# Altium schematic sheet HW_V5.0.SchDoc
size 381 x 241 mm; SheetNumber: 1; SheetTotal: 1
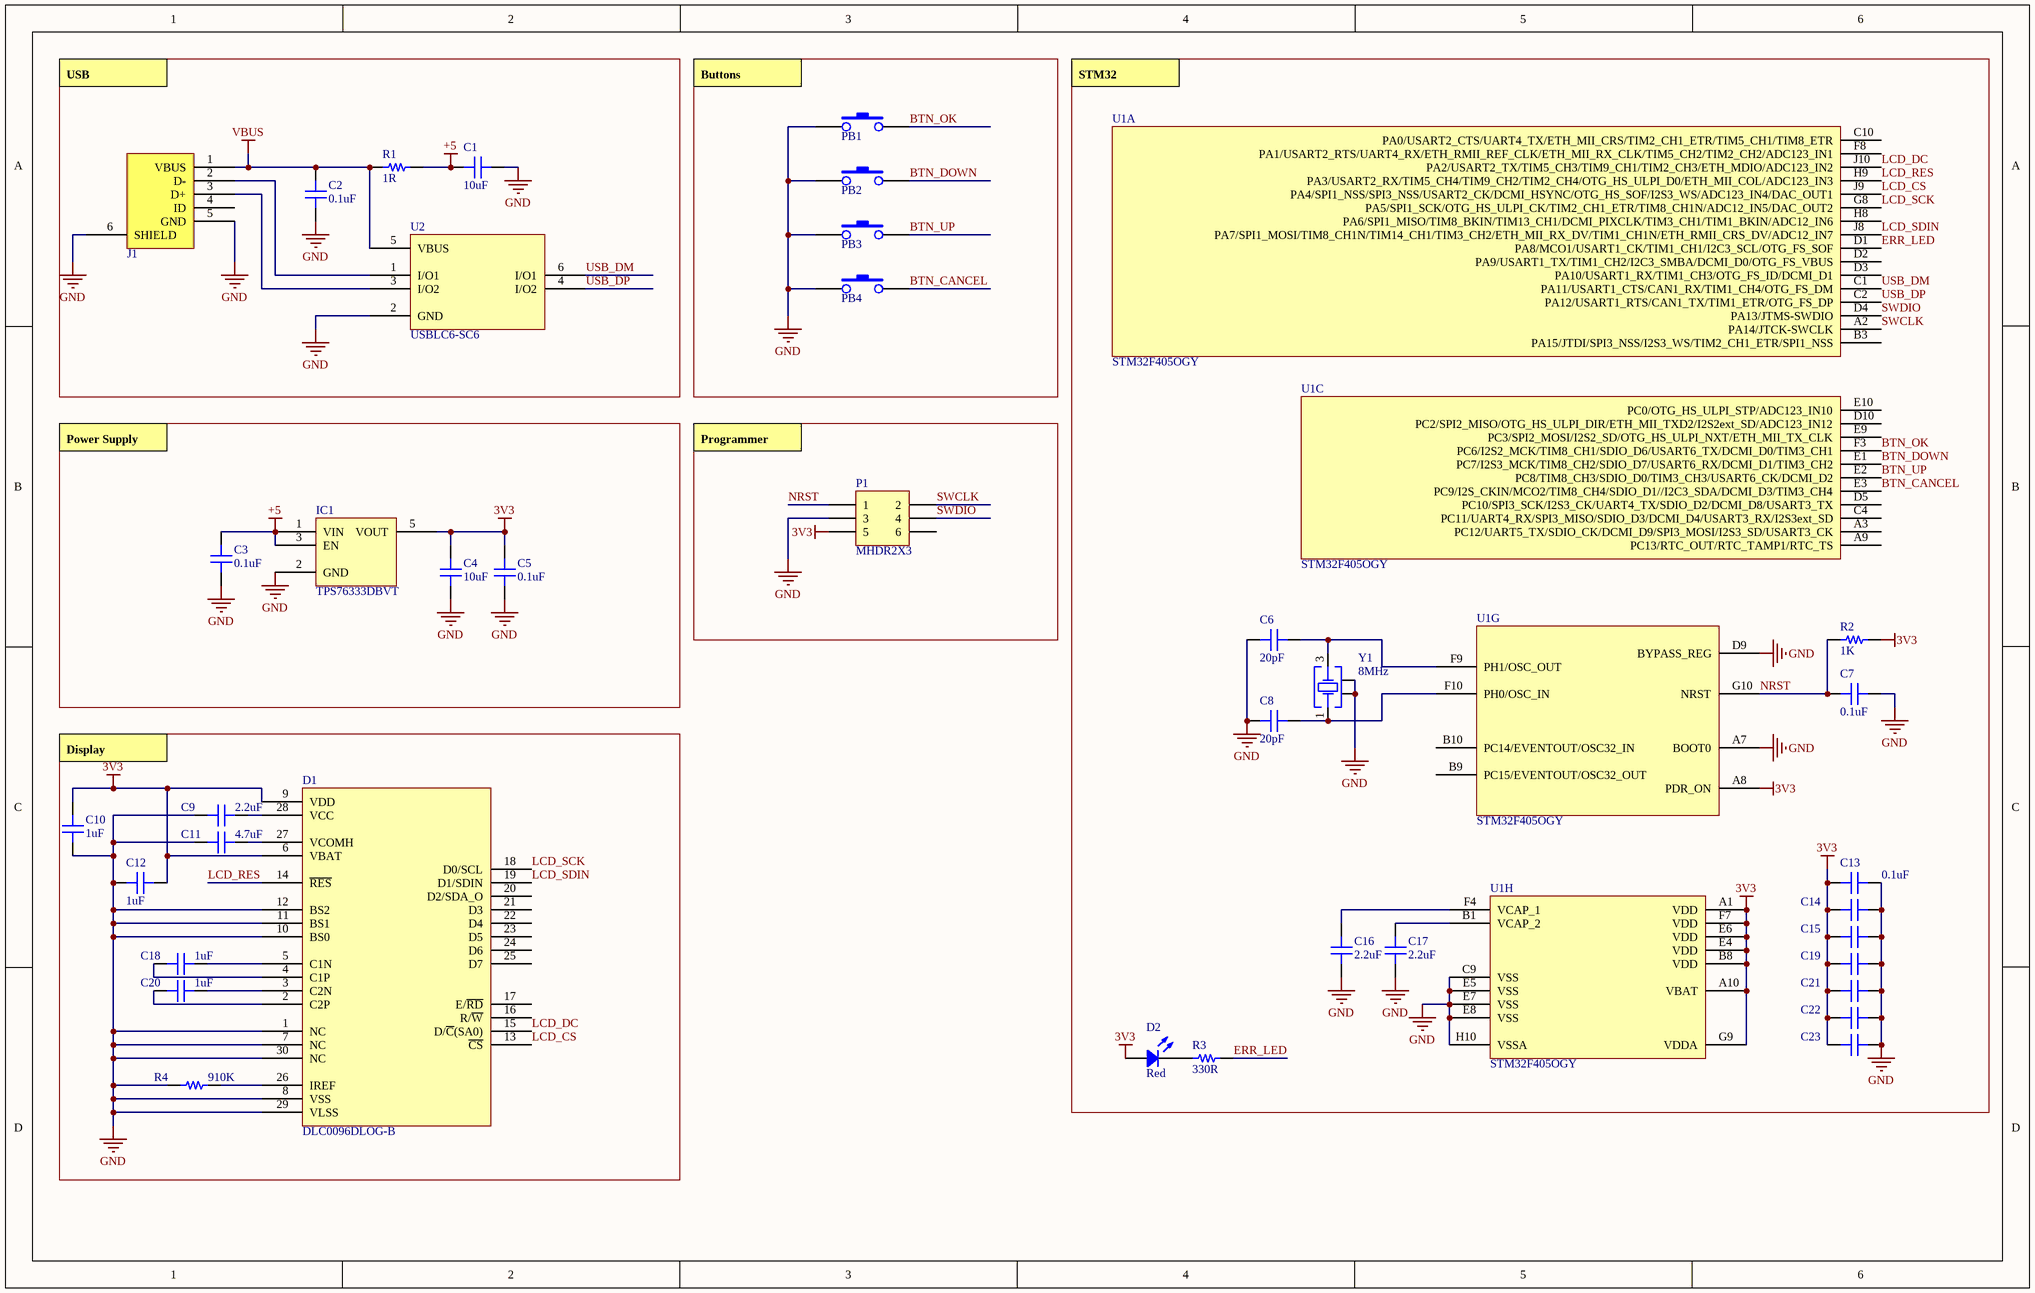
[diagram p0: HW_V5.0.SchDoc]

## Parts
C1  10uF  [CAP 0603/1608]
C2  0.1uF  [CAP 0603/1608]
C3  0.1uF  [CAP 0603/1608]
C4  10uF  [CAP 0603/1608]
C5  0.1uF  [CAP 0603/1608]
C6  20pF  [CAP 0603/1608]
C7  0.1uF  [CAP 0603/1608]
C8  20pF  [CAP 0603/1608]
C9  2.2uF  [CAP 0603/1608]
C10  1uF  [CAP 0603/1608]
C11  4.7uF  [CAP 0603/1608]
C12  1uF  [CAP 0603/1608]
C13  0.1uF  [CAP 0603/1608]
C14  0.1uF  [CAP 0603/1608]  (value not drawn)
C15  0.1uF  [CAP 0603/1608]  (value not drawn)
C16  2.2uF  [CAP 0603/1608]
C17  2.2uF  [CAP 0603/1608]
C18  1uF  [CAP 0603/1608]
C19  0.1uF  [CAP 0603/1608]  (value not drawn)
C20  1uF  [CAP 0603/1608]
C21  0.1uF  [CAP 0603/1608]  (value not drawn)
C22  0.1uF  [CAP 0603/1608]  (value not drawn)
C23  0.1uF  [CAP 0603/1608]  (value not drawn)
D1  DLC0096DLOG-B  [PMOLED_0096_TOP_CONB]
D2  Red  [LED 0603/1608 RED]
IC1  TPS76333DBVT  [TI SOT-23-5 DBV]
J1  U-F-M5DD-W-L  [U-F-M5DD-W-L]  (value not drawn)
P1  MHDR2X3  [MHDR2X3]
PB1  Tactile Switch 3.7 x 3.7  [SW_375_375_4PIN]  (value not drawn)
PB2  Tactile Switch 3.7 x 3.7  [SW_375_375_4PIN]  (value not drawn)
PB3  Tactile Switch 3.7 x 3.7  [SW_375_375_4PIN]  (value not drawn)
PB4  Tactile Switch 3.7 x 3.7  [SW_375_375_4PIN]  (value not drawn)
R1  1R  [RES 0603/1608]
R2  1K  [RES 0603/1608]
R3  330R  [RES 0603/1608]
R4  910K  [RES 0603/1608]
U1  STM32F405OGY  [STM-WLCSP90]  (parts A,C,G,H of 8)
U2  USBLC6-SC6  [ST SOT-23-6]
Y1  8MHz  [WE-XTAL_CFPX-180]

## Nets
3V3: C4.2 C5.2 C10.2 C12.1 C13.2 C14.2 C15.2 C19.2 C21.2 C22.2 C23.2 D1.6(VBAT) D1.9(VDD) D2.1 IC1.5(VOUT) P1.5 R2.2 U1.A1(VDD) U1.A8(PDR_ON) U1.A10(VBAT) U1.B8(VDD) U1.E4(VDD) U1.E6(VDD) U1.F7(VDD) U1.G9(VDDA)
+5: C1.2 C3.2 IC1.1(VIN) IC1.3(EN) R1.2
GND: C1.1 C2.1 C3.1 C4.1 C5.1 C6.1 C7.1 C8.1 C9.2 C10.1 C11.1 C12.2 C13.1 C14.1 C15.1 C16.1 C17.1 C19.1 C21.1 C22.1 C23.1 D1.1(NC) D1.7(NC) D1.8(VSS) D1.10(BS0) D1.11(BS1) D1.12(BS2) D1.29(VLSS) D1.30(NC) IC1.2(GND) J1.5(GND) J1.6(SHIELD) P1.3 PB1.1 PB2.1 PB3.1 PB4.1 R4.1 U1.A7(BOOT0) U1.C9(VSS) U1.D9(BYPASS_REG) U1.E5(VSS) U1.E7(VSS) U1.E8(VSS) U1.H10(VSSA) U2.2(GND) Y1.2(GND&Lid) Y1.4(GND&Lid)
VBUS: C2.2 J1.1(VBUS) R1.1 U2.5(VBUS)
BTN_CANCEL: PB4.2 U1.E3(PC9/I2S_CKIN/MCO2/TIM8_CH4/SDIO_D1//I2C3_SDA/DCMI_D3/TIM3_CH4)
BTN_DOWN: PB2.2 U1.E1(PC7/I2S3_MCK/TIM8_CH2/SDIO_D7/USART6_RX/DCMI_D1/TIM3_CH2)
BTN_OK: PB1.2 U1.F3(PC6/I2S2_MCK/TIM8_CH1/SDIO_D6/USART6_TX/DCMI_D0/TIM3_CH1)
BTN_UP: PB3.2 U1.E2(PC8/TIM8_CH3/SDIO_D0/TIM3_CH3/USART6_CK/DCMI_D2)
ERR_LED: R3.2 U1.D1(PA8/MCO1/USART1_CK/TIM1_CH1/I2C3_SCL/OTG_FS_SOF)
LCD_CS: D1.13(~{CS}) U1.J9(PA4/SPI1_NSS/SPI3_NSS/USART2_CK/DCMI_HSYNC/OTG_HS_SOF/I2S3_WS/ADC123_IN4/DAC_OUT1)
LCD_DC: D1.15(D/~{C}(SA0)) U1.J10(PA2/USART2_TX/TIM5_CH3/TIM9_CH1/TIM2_CH3/ETH_MDIO/ADC123_IN2)
LCD_RES: D1.14(~{RES}) U1.H9(PA3/USART2_RX/TIM5_CH4/TIM9_CH2/TIM2_CH4/OTG_HS_ULPI_D0/ETH_MII_COL/ADC123_IN3)
LCD_SCK: D1.18(D0/SCL) U1.G8(PA5/SPI1_SCK/OTG_HS_ULPI_CK/TIM2_CH1_ETR/TIM8_CH1N/ADC12_IN5/DAC_OUT2)
LCD_SDIN: D1.19(D1/SDIN) U1.J8(PA7/SPI1_MOSI/TIM8_CH1N/TIM14_CH1/TIM3_CH2/ETH_MII_RX_DV/TIM1_CH1N/ETH_RMII_CRS_DV/ADC12_IN7)
NRST: C7.2 P1.1 R2.1 U1.G10(NRST)
SWCLK: P1.2 U1.A2(PA14/JTCK-SWCLK)
SWDIO: P1.4 U1.D4(PA13/JTMS-SWDIO)
USB_DM: U1.C1(PA11/USART1_CTS/CAN1_RX/TIM1_CH4/OTG_FS_DM) U2.6(I/O1)
USB_DP: U1.C2(PA12/USART1_RTS/CAN1_TX/TIM1_ETR/OTG_FS_DP) U2.4(I/O2)
NetC6_2: C6.2 U1.F9(PH1/OSC_OUT) Y1.3(Crystal)
NetC8_2: C8.2 U1.F10(PH0/OSC_IN) Y1.1(Crystal)
NetC9_1: C9.1 D1.28(VCC)
NetC11_2: C11.2 D1.27(VCOMH)
NetC16_2: C16.2 U1.F4(VCAP_1)
NetC17_2: C17.2 U1.B1(VCAP_2)
NetC18_1: C18.1 D1.4(C1P)
NetC18_2: C18.2 D1.5(C1N)
NetC20_1: C20.1 D1.2(C2P)
NetC20_2: C20.2 D1.3(C2N)
NetD1_26: D1.26(IREF) R4.2
NetD2_2: D2.2 R3.1
NetJ1_2: J1.2(D-) U2.1(I/O1)
NetJ1_3: J1.3(D+) U2.3(I/O2)

Not connected (* = marked no-connect by the designer): D1 16(R/~{W}) 17(E/~{RD}) 20(D2/SDA_O) 21(D3) 22(D4) 23(D5) 24(D6) 25(D7); J1 4(ID); P1 6; U1 A3(PC12/UART5_TX/SDIO_CK/DCMI_D9/SPI3_MOSI/I2S3_SD/USART3_CK) A9(PC13/RTC_OUT/RTC_TAMP1/RTC_TS) B3(PA15/JTDI/SPI3_NSS/I2S3_WS/TIM2_CH1_ETR/SPI1_NSS) B9(PC15/EVENTOUT/OSC32_OUT) B10(PC14/EVENTOUT/OSC32_IN) C4(PC11/UART4_RX/SPI3_MISO/SDIO_D3/DCMI_D4/USART3_RX/I2S3ext_SD) C10(PA0/USART2_CTS/UART4_TX/ETH_MII_CRS/TIM2_CH1_ETR/TIM5_CH1/TIM8_ETR) D2(PA9/USART1_TX/TIM1_CH2/I2C3_SMBA/DCMI_D0/OTG_FS_VBUS) D3(PA10/USART1_RX/TIM1_CH3/OTG_FS_ID/DCMI_D1) D5(PC10/SPI3_SCK/I2S3_CK/UART4_TX/SDIO_D2/DCMI_D8/USART3_TX) D10(PC2/SPI2_MISO/OTG_HS_ULPI_DIR/ETH_MII_TXD2/I2S2ext_SD/ADC123_IN12) E9(PC3/SPI2_MOSI/I2S2_SD/OTG_HS_ULPI_NXT/ETH_MII_TX_CLK) E10(PC0/OTG_HS_ULPI_STP/ADC123_IN10) F8(PA1/USART2_RTS/UART4_RX/ETH_RMII_REF_CLK/ETH_MII_RX_CLK/TIM5_CH2/TIM2_CH2/ADC123_IN1) H8(PA6/SPI1_MISO/TIM8_BKIN/TIM13_CH1/DCMI_PIXCLK/TIM3_CH1/TIM1_BKIN/ADC12_IN6)

## Notes on the sheet
- USB
- Buttons
- STM32
- Power Supply
- Programmer
- Display

## Library data of the parts
C1 C4 = CL10A106MQ8NNNC: CAP CER 10UF 6.3V X5R 0603; Manufacturer: Samsung Electro-Mechanics America, Inc.; TemperatureRange: -55C ~ 85C; Tolerance: 20%; Value: 10uF; Part Number: CL10A106MQ8NNNC; PartId: 13031; Supplier 1: Digi-Key; Supplier Part Number 1: 1276-1119-2-ND; ComponentLink1Description: Datasheet; ComponentLink1URL: http://www.samsungsem.com/kr/support/product-search/mlcc/CL10A106MQ8NNNC.jsp; ComponentLink2Description: Digi-Key Listing; ComponentLink2URL: https://www.digikey.com/product-detail/en/samsung-electro-mechanics-america-inc/CL10A106MQ8NNNC/1276-1119-2-ND/3886777; TemperatureCoefficient: X5R; Voltage: 6.3V; Price: 0.0274; Device Package: 0603 (1608 Metric)
C2 C3 C5 C7 C13-C15 C19 C21-C23 = CL10B104JO8NNNC: CAP CER 0.1UF 16V X7R 0603; Manufacturer: Samsung Electro-Mechanics America, Inc.; TemperatureRange: -55C ~ 125C; Tolerance: 5%; Value: 0.1uF; Part Number: CL10B104JO8NNNC; PartId: 5417; Supplier 1: Digi-Key; Supplier Part Number 1: 1276-1061-2-ND; ComponentLink1Description: Datasheet; ComponentLink1URL: http://www.samsungsem.com/kr/support/product-search/mlcc/CL10B104JO8NNNC.jsp; ComponentLink2Description: Digi-Key listing; ComponentLink2URL: http://digikey.com/product-detail/en/CL10B104JO8NNNC/1276-1061-2-ND/3886719; TemperatureCoefficient: X7R; Voltage: 16V; Price: 0.0132; Type: -; Device Package: 0603 (1608 Metric)
C6 C8 = CL10C200JB8NNNC: CAP CER 20PF 50V NP0 0603; Manufacturer: Samsung Electro-Mechanics America, Inc.; TemperatureRange: -55C ~ 125C; TemperatureCoefficient: C0G, NP0; Tolerance: 5%; Value: 20pF; Part Number: CL10C200JB8NNNC; PartId: 5318; Supplier 1: Digi-Key; Supplier Part Number 1: 1276-1187-2-ND; ComponentLink1Description: Datasheet; ComponentLink1URL: http://www.samsungsem.com/kr/support/product-search/mlcc/CL10C200JB8NNNC.jsp; ComponentLink2Description: Digi-Key listing; ComponentLink2URL: http://digikey.com/product-detail/en/CL10C200JB8NNNC/1276-1187-2-ND/3886845; Voltage: 50V; Price: 0.0085; Type: -; Device Package: 0603 (1608 Metric)
C9 C16 C17 = CL10A225KO5LNNC: CAP CER 2.2UF 16V X5R 0603; Manufacturer: Samsung Electro-Mechanics; TemperatureRange: -55C ~ 85C; Tolerance: 10%; Value: 2.2uF; Part Number: CL10A225KO5LNNC; PartId: 30554; Supplier 1: Digi-Key; Supplier Part Number 1: 1276-1880-2-ND; ComponentLink1Description: Datasheet; ComponentLink1URL: http://www.samsungsem.com/kr/support/product-search/mlcc/CL10A225KO5LNNC.jsp; ComponentLink2Description: Digi-Key Listing; ComponentLink2URL: https://www.digikey.com/product-detail/en/samsung-electro-mechanics/CL10A225KO5LNNC/1276-1880-2-ND/3887538; TemperatureCoefficient: X5R; Voltage: 16V; Price: 0; Device Package: 0603 (1608 Metric)
C10 C12 = CL10A105KO8NNNC: CAP CER 1UF 16V X5R 0603; Manufacturer: Samsung Electro-Mechanics America, Inc.; TemperatureRange: -55C ~ 85C; Tolerance: 10%; Value: 1uF; Part Number: CL10A105KO8NNNC; PartId: 13125; Supplier 1: Digi-Key; Supplier Part Number 1: 1276-1034-2-ND; ComponentLink1Description: Datasheet; ComponentLink1URL: http://www.samsungsem.com/kr/support/product-search/mlcc/CL10A105KO8NNNC.jsp; ComponentLink2Description: Digi-Key Listing; ComponentLink2URL: https://www.digikey.com/product-detail/en/samsung-electro-mechanics-america-inc/CL10A105KO8NNNC/1276-1034-2-ND/3886692; TemperatureCoefficient: X5R; Voltage: 16V; Price: 0.0072; Device Package: 0603 (1608 Metric)
C11 = CL10A475KO8NNNC: CAP CER 4.7UF 16V X5R 0603; Manufacturer: Samsung Electro-Mechanics America, Inc.; TemperatureRange: -55C ~ 85C; Tolerance: 10%; Value: 4.7uF; Part Number: CL10A475KO8NNNC; PartId: 13180; Supplier 1: Digi-Key; Supplier Part Number 1: 1276-1784-2-ND; ComponentLink1Description: Datasheet; ComponentLink1URL: http://www.samsungsem.com/kr/support/product-search/mlcc/CL10A475KO8NNNC.jsp; ComponentLink2Description: Digi-Key Listing; ComponentLink2URL: https://www.digikey.com/product-detail/en/samsung-electro-mechanics-america-inc/CL10A475KO8NNNC/1276-1784-2-ND/3887442; TemperatureCoefficient: X5R; Voltage: 16V; Price: 0.0499; Device Package: 0603 (1608 Metric)
C18 C20 = CL10A105KA8NNNC: CAP CER 1UF 25V X5R 0603; Manufacturer: Samsung Electro-Mechanics America, Inc.; TemperatureRange: -55C ~ 85C; Tolerance: 10%; Value: 1uF; Part Number: CL10A105KA8NNNC; PartId: 13209; Supplier 1: Digi-Key; Supplier Part Number 1: 1276-1102-2-ND; ComponentLink1Description: Datasheet; ComponentLink1URL: http://www.samsungsem.com/kr/support/product-search/mlcc/CL10A105KA8NNNC.jsp; ComponentLink2Description: Digi-Key Listing; ComponentLink2URL: https://www.digikey.com/product-detail/en/samsung-electro-mechanics-america-inc/CL10A105KA8NNNC/1276-1102-2-ND/3886760; TemperatureCoefficient: X5R; Voltage: 25V; Price: 0.0082; Device Package: 0603 (1608 Metric)
D2 = LTST-C191KRKT: LED RED CLEAR 0603 SMD; Manufacturer: Lite-On Inc.; Value: Green; Millicandela: 54mcd; Voltage Forward: 2V; Current (Test): 20mA; Viewing Angle: 130; Part Number: LTST-C191KRKT; PartId: 7050; Supplier 1: Digi-Key; Supplier Part Number 1: 160-1447-2-ND; ComponentLink1Description: Datasheet; ComponentLink1URL: http://optoelectronics.liteon.com/upload/download/DS22-2000-223/S_110_LTST-C191KRKT.pdf; ComponentLink2Description: Digi-Key Listing; ComponentLink2URL: http://www.digikey.ca/product-detail/en/LTST-C191KRKT/160-1447-2-ND/386837; Price: 0.0521; Device Package: 0603 (1608 Metric); Colour: Red; Lens Transparency: Clear
IC1 = TPS76333DBVT: IC REG LDO 3.3V 0.15A SOT23-5; Manufacturer: Texas Instruments; Topology: Positive Fixed; Voltage Dropout: 0.3V @ 150mA; Voltage - Input: Up to 10V; Current - Limit (Min): 500mA; Part Number: TPS76333DBVT; PartId: 7953; Supplier 1: Digi-Key; Supplier Part Number 1: 296-2705-2-ND; ComponentLink1Description: Datasheet; ComponentLink1URL: http://www.ti.com/lit/ds/symlink/tps763.pdf; ComponentLink2Description: Digi-Key Listing; ComponentLink2URL: http://www.digikey.ca/product-detail/en/TPS76333DBVT/296-2705-2-ND/306578; Price: 0.8764; Device Package: SC-74A, SOT-753; Voltage - Output: 3.3V; Operating Temperature: -40C ~ 125C
J1 = U-F-M5DD-W-L: USB - Micro B Female USB 2 5 5.06*7.59mm USB Connectors; Part Number: U-F-M5DD-W-L
P1 = MHDR2X3: Header, 3-Pin, Dual row; LatestRevisionDate: 17-Jul-2002; LatestRevisionNote: Re-released for DXP Platform.; Publisher: Altium Limited
R1 = 0603S8J010J: RES SMD 1R OHM 5% 1/8W 0603; Manufacturer: Uniohm; TemperatureRange: -55C ~ 155C; TemperatureCoefficient: 100ppm/C; PowerRating: 0.125W, 1/8W; Value: 1R; Part Number: 0603S8J010J; Tolerance: 5%; Price: 0.0089; Device Package: 1608 (0603 Metric)
R2 = 0603S8J0102: RES SMD 1K OHM 5% 1/8W 0603; Manufacturer: Uniohm; TemperatureRange: -55C ~ 155C; TemperatureCoefficient: 100ppm/C; PowerRating: 0.125W, 1/8W; Value: 1K; Part Number: 0603S8J0102; Tolerance: 5%; Price: 0.0089; Device Package: 1608 (0603 Metric)
R3 = 0603S8J0331: RES SMD 330R OHM 5% 1/8W 0603; Manufacturer: Uniohm; TemperatureRange: -55C ~ 155C; TemperatureCoefficient: 100ppm/C; PowerRating: 0.125W, 1/8W; Value: 330R; Part Number: 0603S8J0331; Tolerance: 5%; Price: 0.0089; Device Package: 1608 (0603 Metric)
R4 = 0603S8J0914: RES SMD 910K OHM 5% 1/8W 0603; Manufacturer: Uniohm; TemperatureRange: -55C ~ 155C; TemperatureCoefficient: 100ppm/C; PowerRating: 0.125W, 1/8W; Value: 910K; Part Number: 0603S8J0914; Tolerance: 5%; Price: 0.0089; Device Package: 1608 (0603 Metric)
U1 = STM32F405OGY6: ARM® Cortex®-M4 series Microcontroller IC 32-Bit 168MHz 1MB (1M x 8) FLASH 90-WLCSP (4.22x3.97); Manufacturer: STMicroelectronics; Core: ARM Cortex-M4; FLASH Size (Prog) (kB): 1024; I/Os (High Current): 72; Internal RAM Size (kB): 192; Operating Frequency(F) (Processor speed) (MHz): 168; Supplier 1: Digi-Key; Supplier 2: Newark; Part Number: STM32F405OGY; ComponentLink1Description: Manufacturer URL; ComponentLink1URL: https://www.st.com/content/st_com/en/products/microcontrollers-microprocessors/stm32-32-bit-arm-cortex-mcus/stm32-high-performance-mcus/stm32f4-series/stm32f405-415/stm32f405og.html; Supplier Part Number 1: 497-17431-1-ND; Supplier Part Number 2: 66W7295
U2 = USBLC6-2: TVS DIODE 5.25V 17V SOT23-6; Manufacturer: STMicroelectronics; Part Number: USBLC6-SC6; Supplier 1: Newark; Supplier 2: Digi-Key; Supplier Part Number 1: 26M4748; Supplier Part Number 2: 497-11883-1-ND; Device Package: SOT-23-6; Operating Temperature: -40°C ~ 125°C (TJ)
Y1 = 830108313809: WE-XTAL Quartz Crystal, SMT, CFPX-180, 8MHz, +/-30ppm; Manufacturer: Wurth Elektronik; Frequency Stability: +/-50ppm; Load Capacitance: 12pF; ComponentLink1Description: Manufacturer; ComponentLink1URL: http://www.we-online.de; ComponentLink2Description: Datasheet; ComponentLink2URL: https://www.we-online.com/catalog/datasheet/830108313809.pdf; Operating Temperature: -40 to +85degC; Packaging: Tape and Reel; Manufacturer Part Number: 830108313809; Published Date: November 2020; Size: CFPX-180; Frequency: 8MHz; Frequency Tolerance: +/-30ppm; Mounting Technology: SMT
D1 = DLC0096DLOG-B: Part Number: DLC0096DLOG-B